# EasyEDA schematic easyeda-v1-0.json
TITLE: ESPHome Aldes T.One; REV: 1.0; Date: 2024-11-19; Sheet: 1/1; Drawn By: guillaume.duveau; Company: Guillaume Duveau
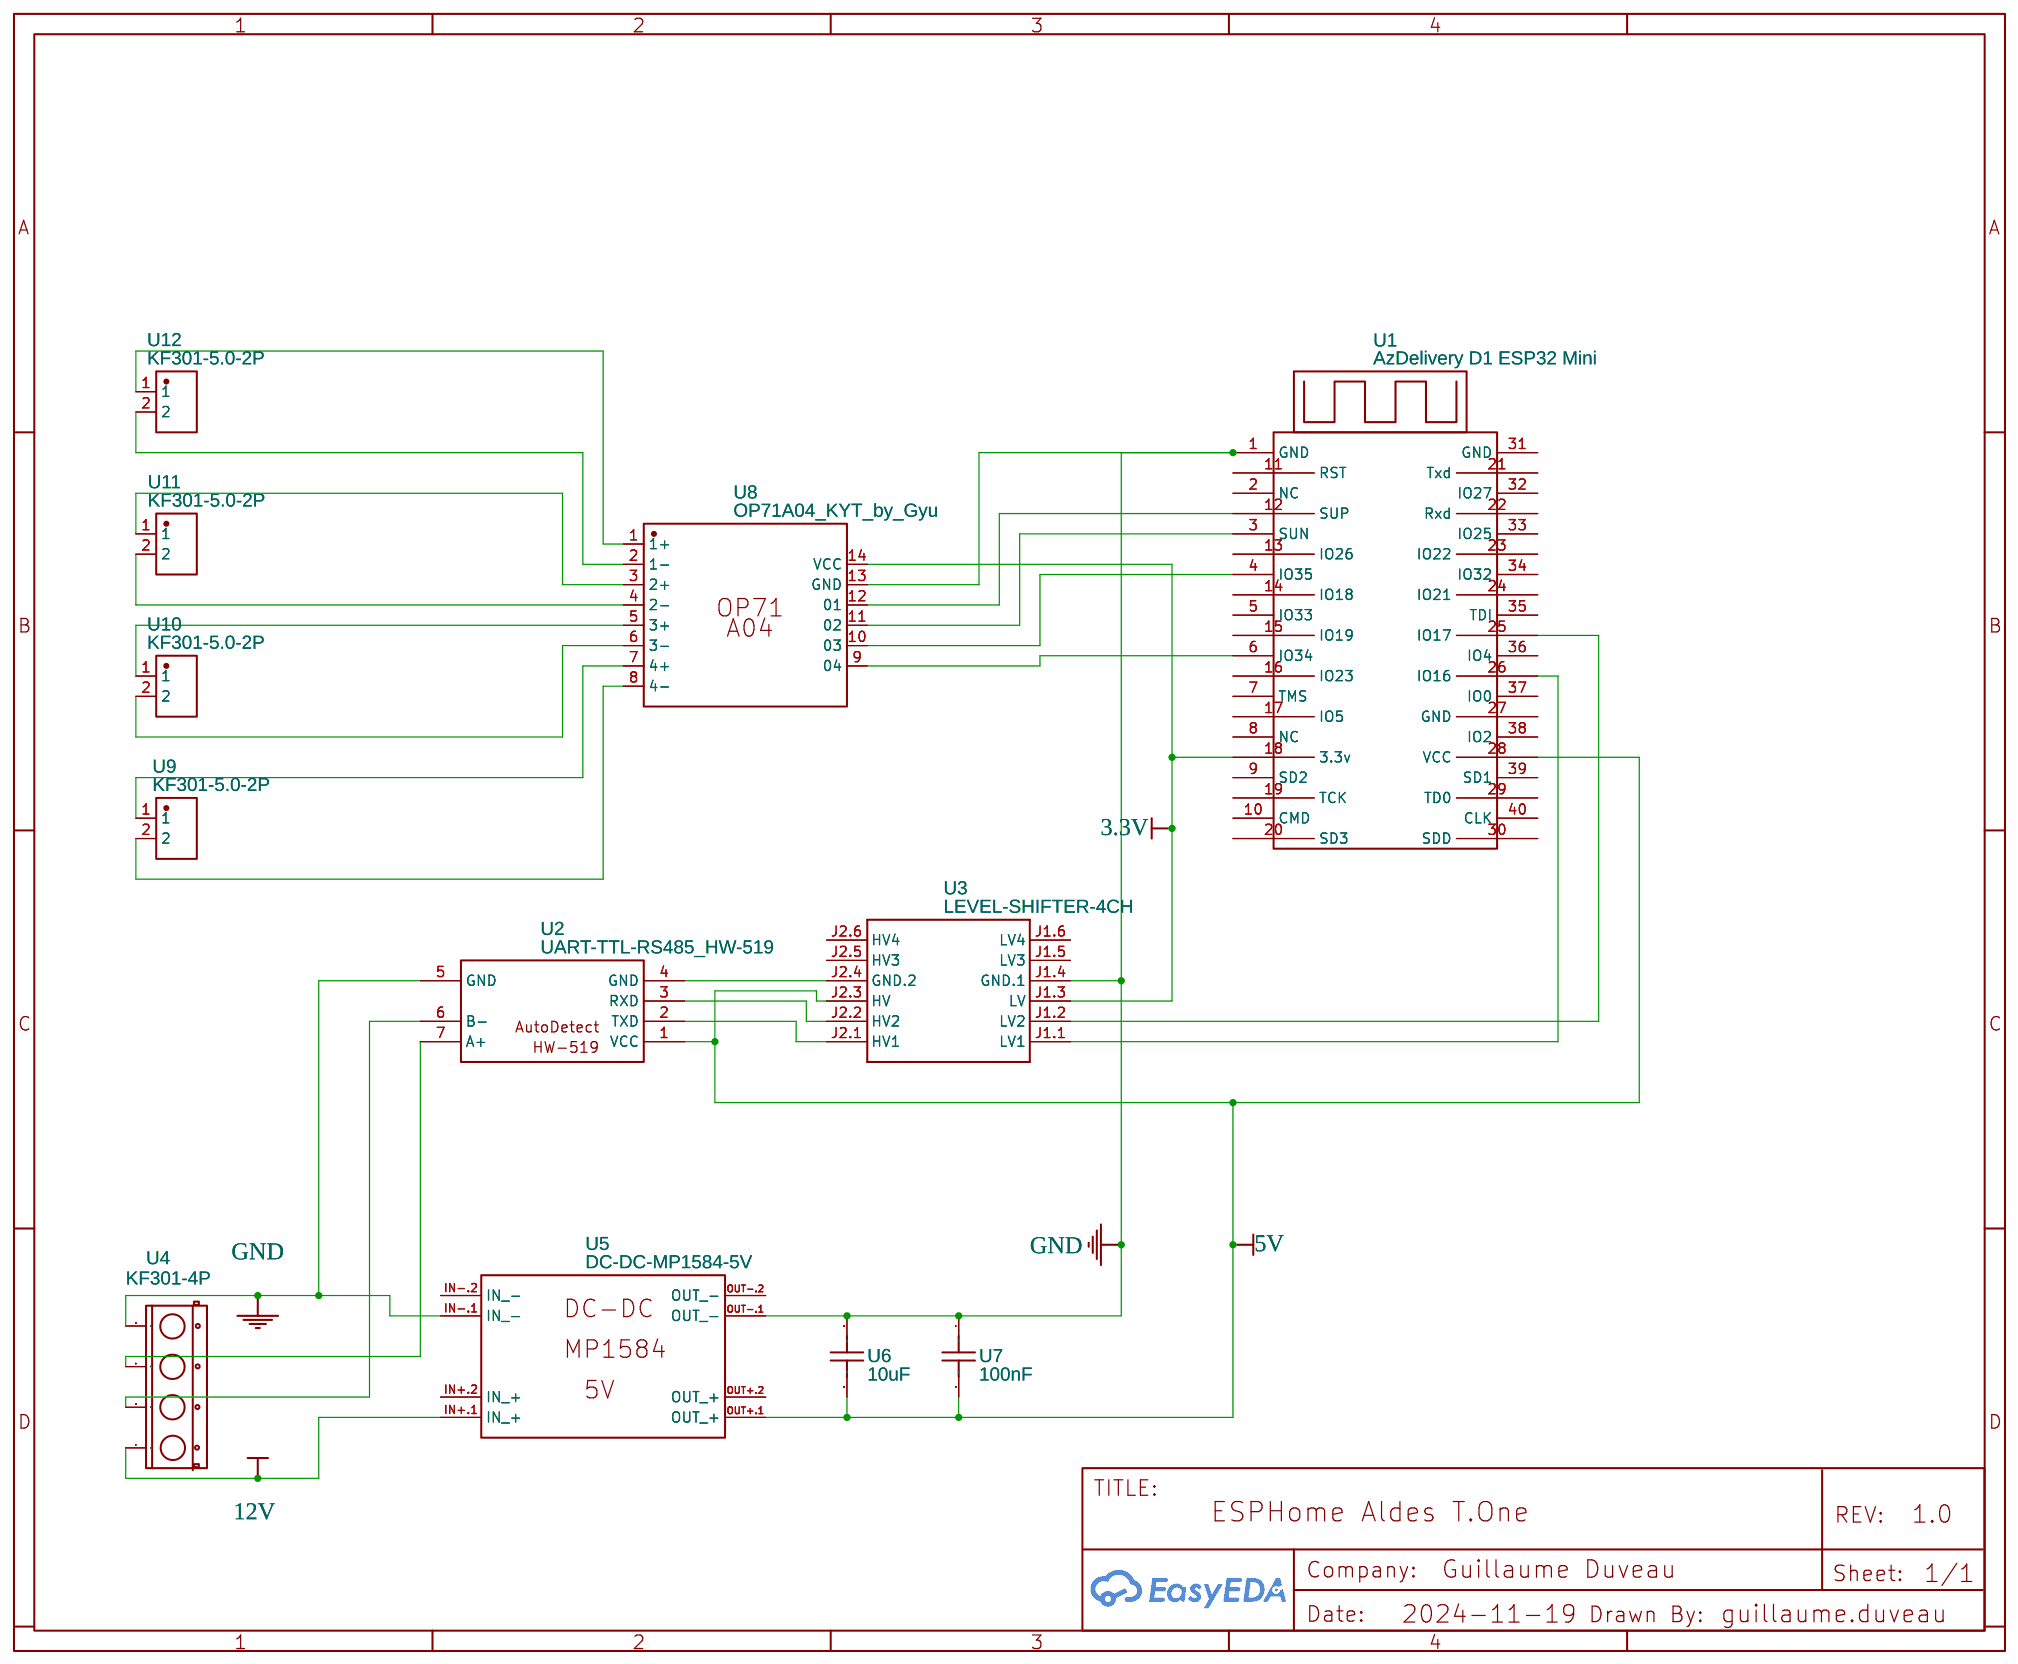
[diagram p0: schematic sheet]

## Parts
U1  AzDelivery D1 ESP32 Mini  [AZDELIVERYD1 ESP32 MINI]
U2  UART-TTL-RS485_HW-519  [UART-TTL-RS485. V2]
U3  LEVEL-SHIFTER-4CH  [LEVEL-SHIFTER-4CH]
U4  KF301-4P  [KF301-4P]
U5  DC-DC-MP1584-5V  [DC-DC-STEP-DOWN-MP1584]
U6  10uF  [C1206]
U7  100nF  [C1206]
U8  OP71A04_KYT_by_Gyu  [OP71]
U9  KF301-5.0-2P  [CONN-TH_P5.00_KF301-5.0-2P]
U10  KF301-5.0-2P  [CONN-TH_P5.00_KF301-5.0-2P]
U11  KF301-5.0-2P  [CONN-TH_P5.00_KF301-5.0-2P]
U12  KF301-5.0-2P  [CONN-TH_P5.00_KF301-5.0-2P]

## Library data of the parts
U1 = AzDelivery D1 ESP32 Mini: Manufacturer: AzDelivery; Manufacturer Part: D1 Mini ESP32; Supplier: AzDelivery; Supplier Part: D1 mini ESP32; link: https://www.az-delivery.de/nl/products/esp32-d1-mini; Contributor: Jelke; Package Display: No
U2 = UART-TTL-RS485_HW-519: Contributor: Compesalogger
U3 = LEVEL-SHIFTER-4CH: Contributor: jboutin
U4 = KF301-4P: Manufacturer Part: KF301; Contributor: Mars M
U5 = DC-DC-MP1584-5V: Contributor: karel.slavicek
U6 = TMK316AB7106KLHT_C20505300: Supplier: LCSC; Supplier Part: C20505300; Manufacturer: TAIYO YUDEN(太诱); Manufacturer Part: TMK316AB7106KLHT; JLCPCB Part Class: Extended Part; Contributor: lcsc
U7 = GA1206H104MBXBR31G: Contributor: LCSC; Supplier: LCSC; Supplier Part: C2308240; Manufacturer: VISHAY(威世); JLCPCB Part Class: Extended Part
U8 = OP71A04_KYT_by_Gyu: Contributor: jirwald; Package Display: No
U9-U11 = KF301-5.0-2P: Contributor: LCSC; Supplier: LCSC; Supplier Part: C474881; Manufacturer: KEFA(科发); JLCPCB Part Class: Extended Part
U12 = KF301-5.0-2P: Contributor: LCSC; Supplier: LCSC; Supplier Part: C474881; Manufacturer: KEFA(科发); JLCPCB Part Class: Extended Part; Package Display: No

## Nets
3.3V: U1.18(3.3v) U3.J1.3(LV) U8.14(VCC)
5V: U1.28(VCC) U2.1(VCC) U3.J2.3(HV) U5.OUT+.1(OUT +) U6.2 U7.2
12V: U4.4 U5.IN+.1(IN +)
GND: U1.1(GND) U2.5(GND) U3.J1.4(GND.1) U4.1 U5.IN-.1(IN -) U5.OUT-.1(OUT -) U6.1 U7.1 U8.13(GND)
Net-(U1-3): U1.3(SUN) U8.11(02)
Net-(U1-4): U1.4(IO35) U8.10(03)
Net-(U1-6): U1.6(IO34) U8.9(04)
Net-(U1-12): U1.12(SUP) U8.12(01)
Net-(U1-25): U1.25(IO17) U3.J1.2(LV2)
Net-(U1-26): U1.26(IO16) U3.J1.1(LV1)
Net-(U2-2): U2.2(TXD) U3.J2.1(HV1)
Net-(U2-3): U2.3(RXD) U3.J2.2(HV2)
Net-(U2-4): U2.4(GND) U3.J2.4(GND.2)
Net-(U2-6): U2.6(B-) U4.3
Net-(U2-7): U2.7(A+) U4.2
Net-(U8-1): U8.1(1+) U12.1
Net-(U8-2): U8.2(1-) U12.2
Net-(U8-3): U8.3(2+) U11.1
Net-(U8-4): U8.4(2-) U11.2
Net-(U8-5): U8.5(3+) U10.1
Net-(U8-6): U8.6(3-) U10.2
Net-(U8-7): U8.7(4+) U9.1
Net-(U8-8): U8.8(4-) U9.2

Not connected (* = marked no-connect by the designer): U1 2(NC) 5(IO33) 7(TMS) 8(NC) 9(SD2) 10(CMD) 11(RST) 13(IO26) 14(IO18) 15(IO19) 16(IO23) 17(IO5) 19(TCK) 20(SD3) 21(Txd) 22(Rxd) 23(IO22) 24(IO21) 27(GND) 29(TD0) 30(SDD) 31(GND) 32(IO27) 33(IO25) 34(IO32) 35(TDI) 36(IO4) 37(IO0) 38(IO2) 39(SD1) 40(CLK); U3 J1.5(LV3) J1.6(LV4) J2.5(HV3) J2.6(HV4); U5 IN+.2(IN +) IN-.2(IN -) OUT+.2(OUT +) OUT-.2(OUT -)
